# EAGLE design 2mm_Header_Adaptor (EAGLE 6.3)
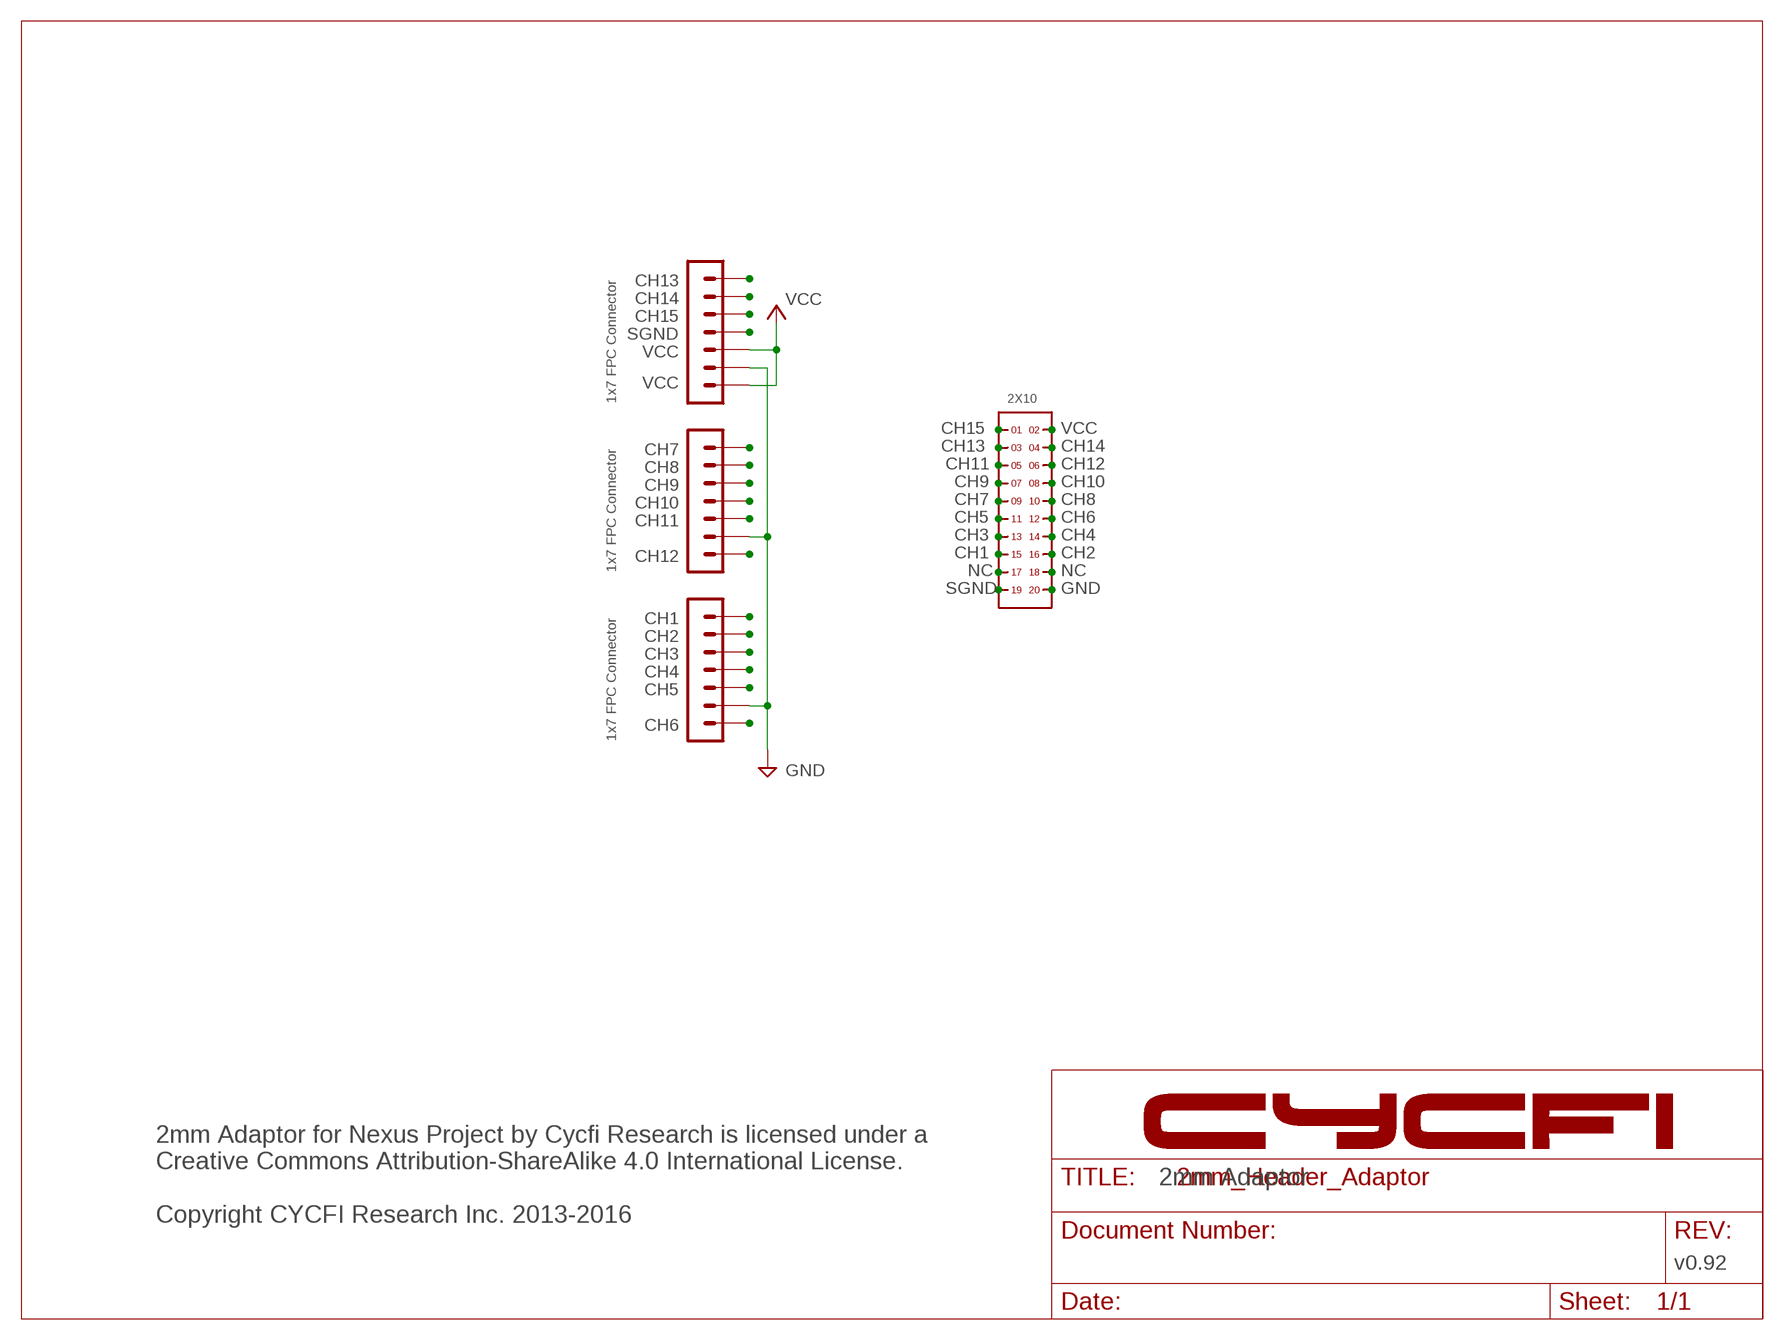
[diagram p0: schematic, sheet 1]

## Parts
H1  7P_ZIF_59453-071110EDHLF  [7P_ZIF_59453-071110EDHLF]
H2  7P_ZIF_59453-071110EDHLF  [7P_ZIF_59453-071110EDHLF]
H3  7P_ZIF_59453-071110EDHLF  [7P_ZIF_59453-071110EDHLF]
H4  2X10  [2X10]

## Nets
CH1: H1.P$7 H4.15
CH2: H1.P$6 H4.16
CH3: H1.P$5 H4.13
CH4: H1.P$4 H4.14
CH5: H1.P$3 H4.11
CH6: H1.P$1 H4.12
CH7: H2.P$7 H4.9
CH8: H2.P$6 H4.10
CH9: H2.P$5 H4.7
CH10: H2.P$4 H4.8
CH11: H2.P$3 H4.5
CH12: H2.P$1 H4.6
GND: H1.P$2 H2.P$2 H3.P$2 H4.20
MIDI1: H3.P$7 H4.3
MIDI2: H3.P$6 H4.4
MIDI3: H3.P$5 H4.1
NC1: H4.17
NC2: H4.18
VCC: H3.P$1 H3.P$3 H4.2
VGND: H3.P$4 H4.19

## Notes on the sheet
- CH13
- CH14
- CH15
- SGND
- VCC
- VCC
- 1x7 FPC Connector
- CH15 | VCC
- CH7
- CH13 | CH14
- CH8
- CH11 | CH12
- CH9
- CH9 | CH10
- CH10
- CH7 | CH8
- CH11
- CH5 | CH6
- CH3 | CH4
- CH12
- CH1 | CH2
- 1x7 FPC Connector
- NC | NC
- SGND | GND
- CH1
- CH2
- CH3
- CH4
- CH5
- CH6
- 1x7 FPC Connector
- 2mm Adaptor
- 2mm Adaptor for Nexus Project by Cycfi Research is licensed under a 
  Creative Commons Attribution-ShareAlike 4.0 International License. 
  
  Copyright CYCFI Research Inc. 2013-2016
- v0.92

## Library data of the parts
H1-H3 = CYCFI_Con:7P_ZIF_59453-071110EDHLF
H4 = headers(2mm):2X10

## Board
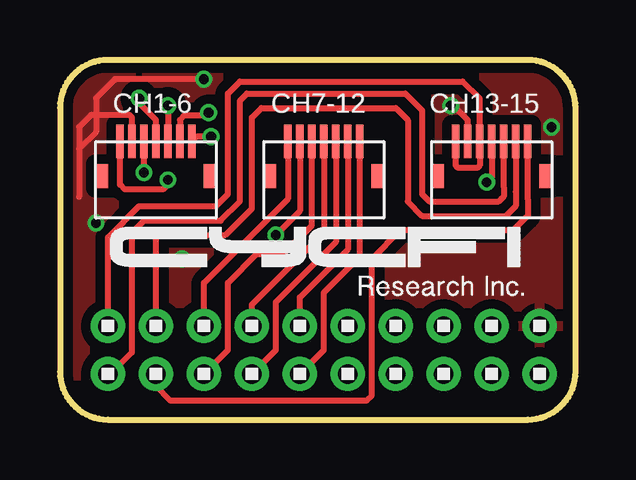
[diagram p1: board, top side]
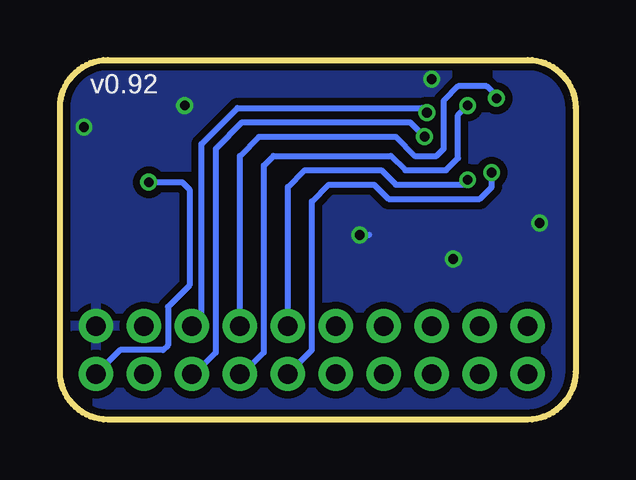
[diagram p2: board, bottom side, seen from below]

Size 21.5 x 15 mm. Coordinates in mm from the lower left corner, seen from the top.
Outline: 0,13 0,2 arc90 2,0 19.5,0 arc90 21.5,2 21.5,13 arc90 19.5,15 2,15 arc90 0,13
Copper layers (1*16): Top 0.035mm / dielectric 1.5mm / Bottom 0.035mm
Design rules "Fusion_eagle_rule_v1.1": minimum track width 6mil, minimum drill 12mil, track to track 6mil, track to pad 6mil, pad to pad 6mil, via to via 6mil, smd to smd 0mil, copper to edge 10mil, drill to drill 10mil, minimum pad ring 10mil, minimum via ring 6mil, stop-mask expansion 2mil, vias tented up to drill 100mil, thermal gap 10mil

### Footprints (pad centres in the part's own frame; a part is rotated, then mirrored left to right if it is on the bottom)
7P_ZIF_59453-071110EDHLF = smd 0.3 x 1.4: P$1 -1.5,1.6; P$2 -1,1.6; P$3 -0.5,1.6; P$4 0,1.6; P$5 0.5,1.6; P$6 1,1.6; P$7 1.5,1.6 | smd 0.52 x 1: ST1 -2.24,0.15; ST2 2.24,0.15
2X10 = drill 0.8 pad 1.422: 1 -9,-1; 2 -9,1; 3 -7,-1; 4 -7,1; 5 -5,-1; 6 -5,1; 7 -3,-1; 8 -3,1; 9 -1,-1; 10 -1,1; 11 1,-1; 12 1,1; 13 3,-1; 14 3,1; 15 5,-1; 16 5,1; 17 7,-1; 18 7,1; 19 9,-1; 20 9,1

### Placement (x,y rotation side)
H1  4,10 0 top
H2  11,10 0 top
H3  18,10 0 top
H4  11,2.9 0 top

### Tracks (layer width: path | path; a pad name or v marks a point on that pad's centre or on a via)
CH1  (via drill 0.4)
  Top 0.254: v6.3,11.8 5.7,11.8 H1.P$7
  Bottom 0.254: H4.15 15.9,1.9 15,2.8 15,11.3 13.9,12.4 6.9,12.4 v6.3,11.8
CH2  (via drill 0.4)
  Top 0.254: H1.P$6 5,12.5 5.2,12.7 6.1,12.7 v6.2,12.8
  Bottom 0.254: H4.16 16,4 15.6,4.4 15.6,11.5 14.1,13 6.4,13 v6.2,12.8
CH3  (via drill 0.4)
  Top 0.254: v4.5,13.1 H1.P$5
  Bottom 0.254: H4.13 13.9,1.9 13,2.8 13,10.6 12.6,11 7.7,11 7.1,10.4 5.4,10.4 4.9,10.9 4.9,12.7 v4.5,13.1
CH4  (via drill 0.4)
  Top 0.254: H1.P$4 4,12.5 3.3,13.2 v3.3,13.4
  Bottom 0.254: H4.14 14,11 13.2,11.8 7.5,11.8 6.7,11 5.8,11 5.5,11.3 5.5,13.3 4.9,13.9 3.7,13.9 3.3,13.5 v3.3,13.4
CH5  (via drill 0.4)
  Top 0.254: v3.5,10.3 H1.P$3
  Bottom 0.254: H4.11 11,2.9 11,9.1 10.3,9.8 8.4,9.8 7.8,9.2 4,9.2 3.5,9.7 v3.5,10.3
CH6  (via drill 0.4)
  Top 0.254: v4.5,10 4.5,9.8 4.3,9.6 2.7,9.6 2.5,9.8 H1.P$1
  Bottom 0.254: H4.12 12,9.7 11.3,10.4 8.1,10.4 7.5,9.8 4.6,9.8 4.5,9.9 v4.5,10
CH7
  Top 0.254: H4.9 11,2.9 11,5.3 12.5,6.8 H2.P$7
CH8
  Top 0.254: H2.P$6 12,7.1 10,5.1 H4.10
CH9
  Top 0.254: H4.7 9,2.9 9,4.9 11.5,7.4 H2.P$5
CH10
  Top 0.254: H2.P$4 11,7.8 8,4.8 H4.8
CH11
  Top 0.254: H4.5 7,2.9 7,5.7 8.2,6.9 9.3,6.9 10.5,8.1 H2.P$3
CH12
  Top 0.254: H4.6 6,5.7 9.5,9.2 H2.P$1
GND  (via drill 0.4)
  Top 0.254: H1.P$2 3,12.6 2.9,12.7 1.3,12.7 0.8,12.2 0.8,11.3 | 0.8,11.3 0.8,9.3 | H3.P$2 17,12.5 16.3,13.2 | H2.P$2 10,8.7 v9,7.7 | v6,14.2 2.3,14.2 1.5,13.4 1.5,12 0.8,11.3
  Bottom 0.254: v9,7.7 8.6,7.7
  other vias: 1.5,8.2 5.1,6.7 20.5,12.2 16.3,13.1
  pour Top (isolate 0.406): 2,15 19.5,15 arc-90 21.5,13 21.5,2 arc-90 19.5,0 2,0 arc-90 0,2 0,13 arc-90
  pour Bottom (isolate 0.305): 2,15 19.5,15 arc-90 21.5,13 21.5,2 arc-90 19.5,0 2,0 arc-90 0,2 0,13 arc-90
MIDI1
  Top 0.254: H4.3 4,1.4 4.6,0.8 12.8,0.8 13,1 13,6.7 14.2,7.9 18.9,7.9 19.4,8.4 19.5,8.5 19.5,9.2 H3.P$7
MIDI2
  Top 0.254: H4.4 4,7.6 4.1,7.7 6.9,7.7 8,8.8 8,12.6 8.4,13 14,13 14.5,12.5 14.5,9.1 15.1,8.5 18.6,8.5 19,8.9 19,9.5 H3.P$6
MIDI3
  Top 0.254: H4.1 2.1,1.9 3,2.8 3,7.8 3.5,8.3 6.7,8.3 7.5,9.1 7.5,13.3 7.8,13.6 14.4,13.6 15.1,12.9 15.1,9.4 15.4,9.1 18.3,9.1 18.4,9.2 18.5,9.3 18.5,9.7 H3.P$5
VCC
  Top 0.254: H4.2 2,7.6 3.3,8.9 6.5,8.9 7,9.4 7,13.6 7.5,14.1 16.8,14.1 17.5,13.4 H3.P$3 17.5,10.6 17.4,10.5 16.6,10.5 16.5,10.6 H3.P$1
VGND  (via drill 0.4)
  Top 0.254: H3.P$4 18,10.1 v17.8,9.9
  Bottom 0.254: v17.8,9.9 16.4,9.9 16.1,9.6 16.1,5.6 17,4.7 17,3.1 17.2,2.9 19,2.9 H4.19

### Text on the board
tNames: CH1-6 | CH7-12 | CH13-15
bNames: v0.92
_tNames: CH1-6 | CH7-12 | CH13-15
_bNames: v0.92